# Altium schematic sheet 02-System.SchDoc: System Block Diagram
size A2; DocumentNumber: 2; SheetNumber: 2; SheetTotal: 15
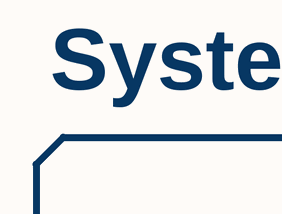
[diagram p0: 02-System.SchDoc, top left]
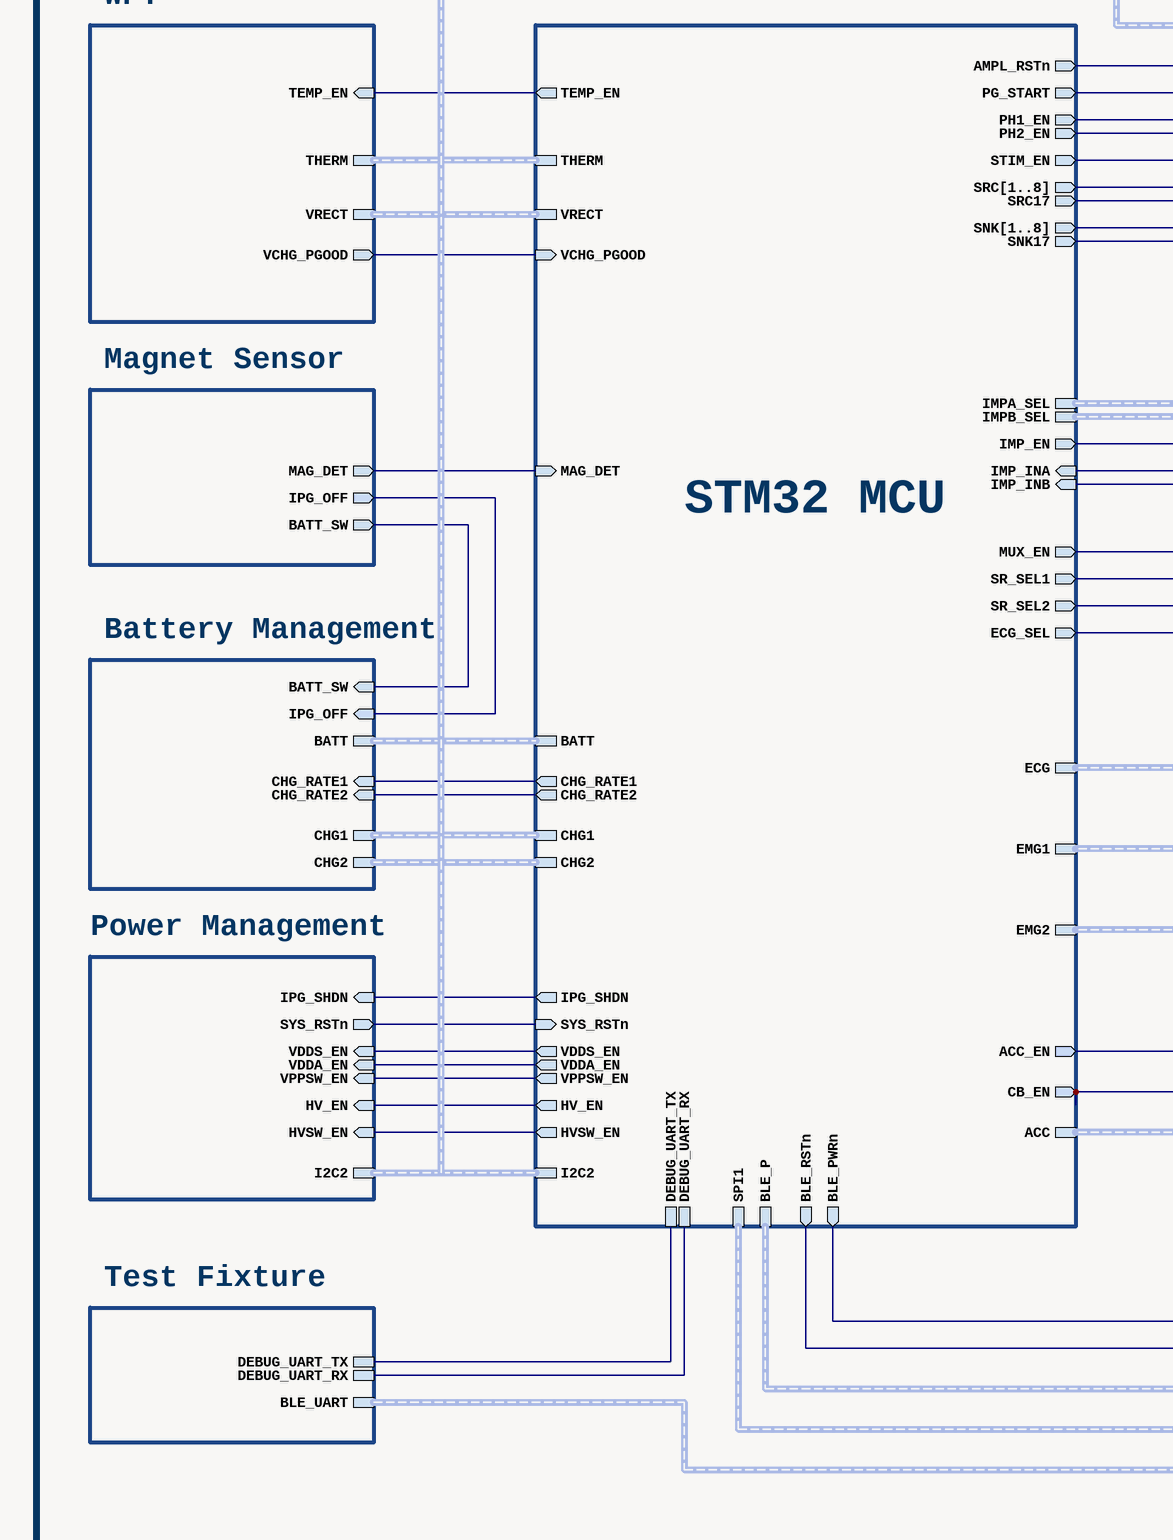
[diagram p1: 02-System.SchDoc, bottom left]
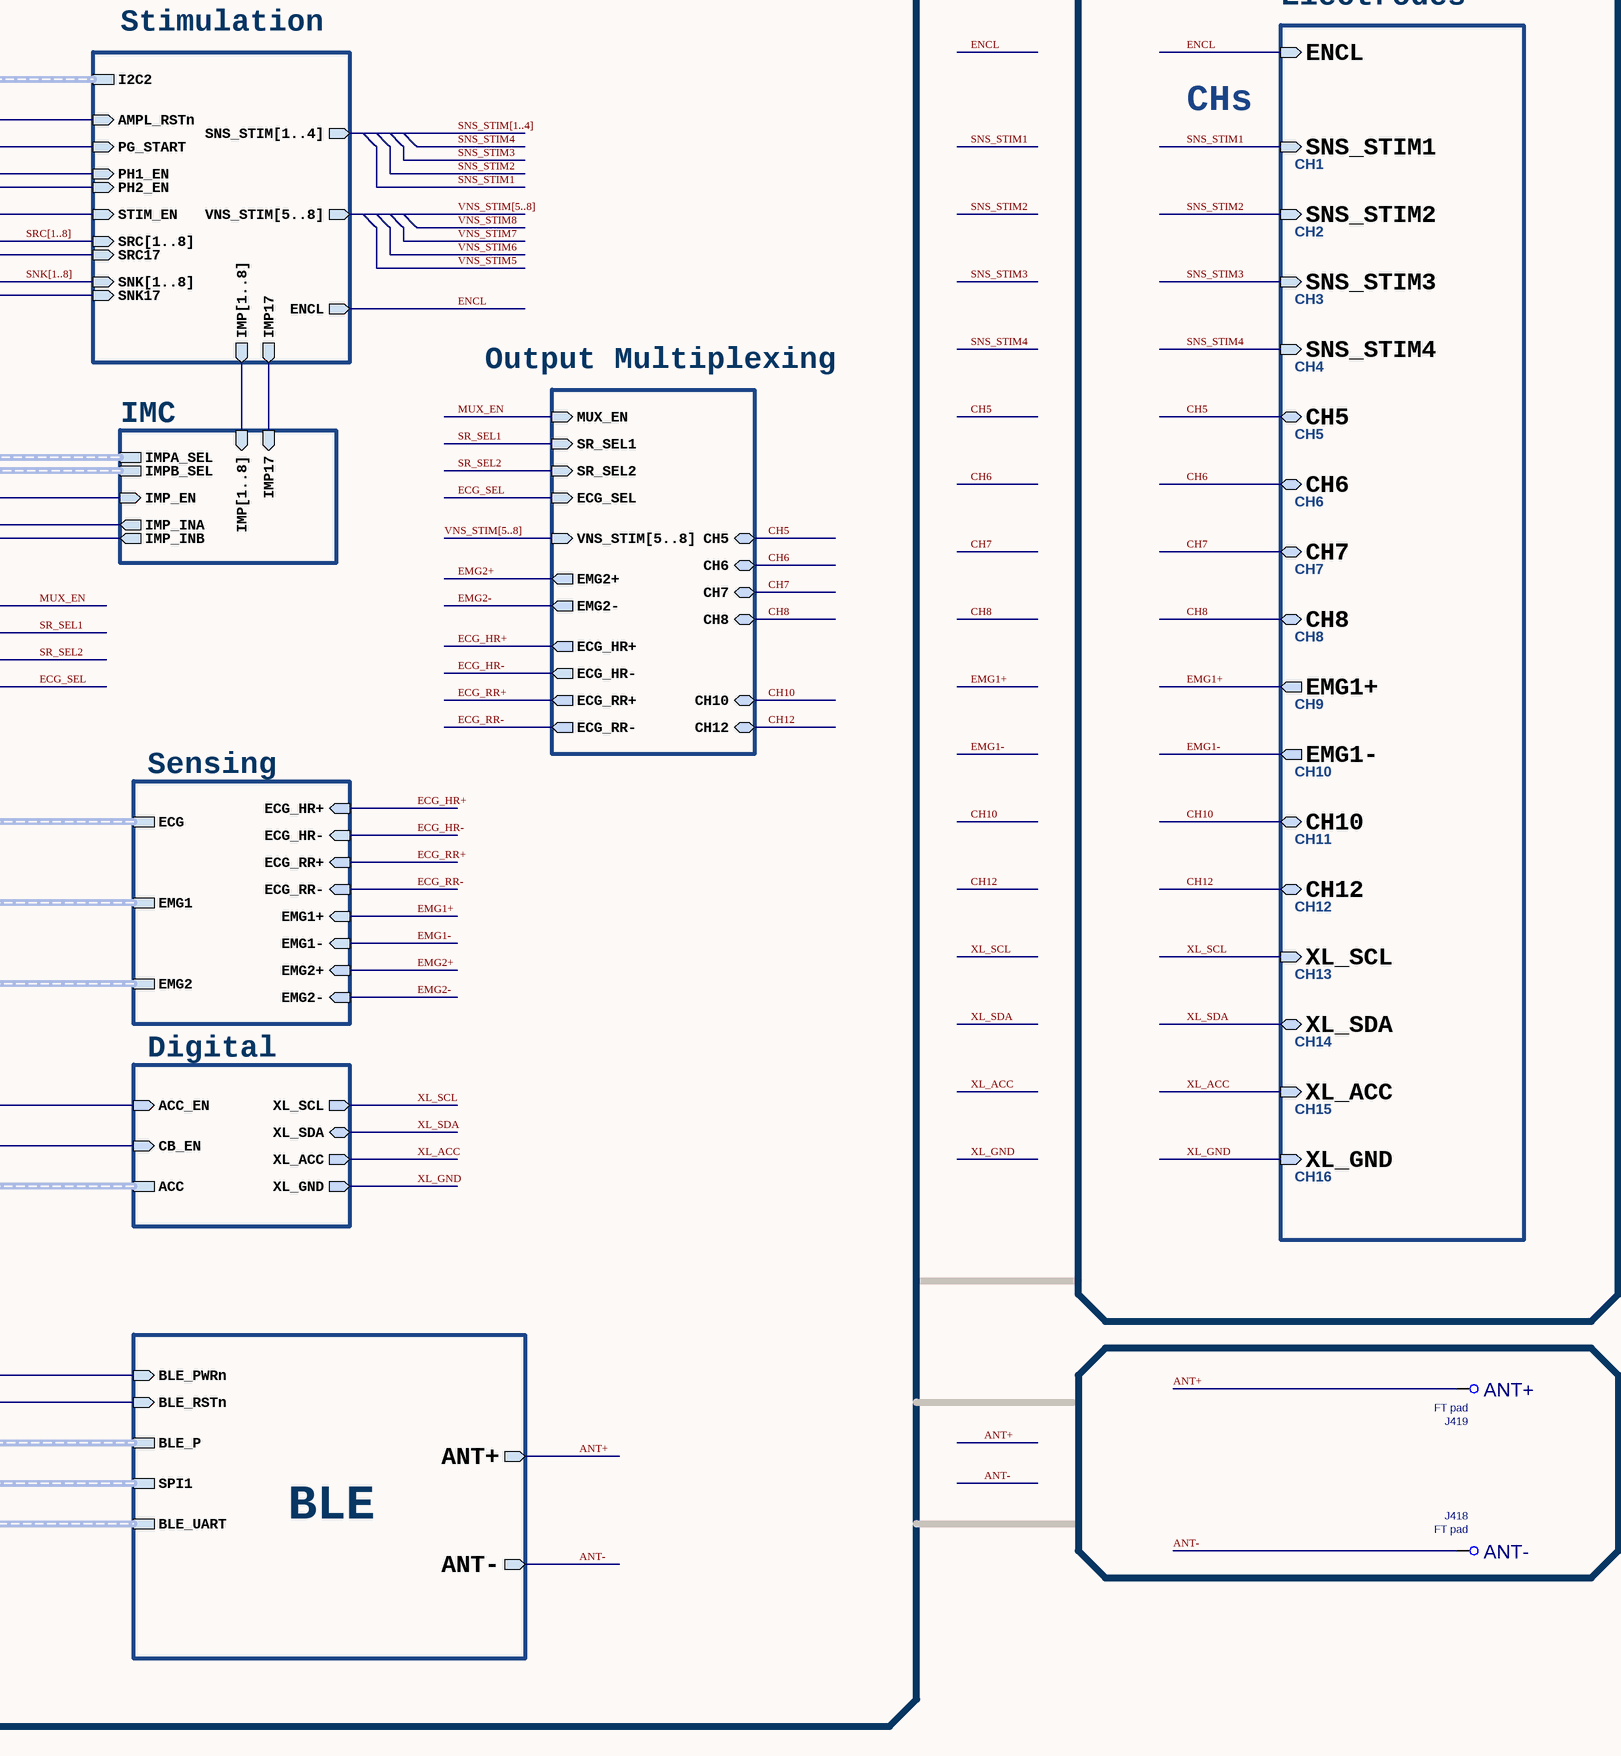
[diagram p2: 02-System.SchDoc, bottom right]

## Parts
J418  value FT pad  [FEEDHOLE_20mil]  (hidden comment: THPAD_20m)  (no BOM)
J419  value FT pad  [FEEDHOLE_20mil]  (hidden comment: THPAD_20m)  (no BOM)

## Sub-sheets
Battery Management = 06-BatteryManagement.SchDoc: CHG_RATE1 (in), CHG_RATE2 (in), BATT_SW (in), CHG1 (harness CHG_CTRL), CHG2 (harness CHG_CTRL), BATT (harness BATT), IPG_OFF (in)
BLE = 04-BLE.SchDoc: BLE_RSTn (in), BLE_PWRn (in), BLE_P (harness BLE PINS), ANT+ (out), ANT- (out), SPI1 (harness BLE_SPI), BLE_UART (harness UART)
Digital = 13-Digital.SchDoc: ACC_EN (in), CB_EN (in), ACC (harness I2C), XL_SCL (out), XL_SDA (bidir), XL_ACC (out), XL_GND (out)
Electrodes = 12-Electrodes.SchDoc: SNS_STIM1 (in), ENCL (in), SNS_STIM2 (in), SNS_STIM3 (in), SNS_STIM4 (in), CH5 (bidir), CH6 (bidir), CH7 (bidir), CH8 (bidir), EMG1+ (out), EMG1- (out), CH10 (bidir), CH12 (bidir), XL_SCL (in), XL_SDA (bidir), XL_ACC (in), XL_GND (in)
IMC = 09-IMC.SchDoc: IMP[1..8] (in), IMP17 (in), IMPA_SEL (harness MUX_SEL), IMPB_SEL (harness MUX_SEL), IMP_EN (in), IMP_INA (out), IMP_INB (out)
Magnet Sensor = 08-MagnetSensor.SchDoc: MAG_DET (out), BATT_SW (out), IPG_OFF (out)
Output Multiplexing = 15-OutputMultiplexing.SchDoc: MUX_EN (in), SR_SEL1 (in), SR_SEL2 (in), ECG_SEL (in), VNS_STIM[5..8] (in), EMG2+ (out), EMG2- (out), ECG_HR- (out), ECG_HR+ (out), ECG_RR+ (out), ECG_RR- (out), CH5 (bidir), CH6 (bidir), CH7 (bidir), CH8 (bidir), CH10 (bidir), CH12 (bidir)
Power Management = 07-PowerManagement.SchDoc: IPG_SHDN (in), SYS_RSTn (out), HVSW_EN (in), HV_EN (in), VPPSW_EN (in), VDDS_EN (in), VDDA_EN (in), I2C2 (harness I2C)
Sensing = 10-Sensing.SchDoc: EMG1+ (in), EMG1- (in), ECG_HR- (in), EMG1 (harness EMG), ECG (harness ECG), ECG_HR+ (in), EMG2 (harness EMG), ECG_RR+ (in), ECG_RR- (in), EMG2+ (in), EMG2- (in)
Stimulation = 11-Stimulation.SchDoc: PG_START (in), AMPL_RSTn (in), PH1_EN (in), PH2_EN (in), STIM_EN (in), SRC[1..8] (in), SRC17 (in), SNK[1..8] (in), SNK17 (in), SNS_STIM[1..4] (out), ENCL (out), IMP[1..8] (out), IMP17 (out), VNS_STIM[5..8] (out), I2C2 (harness I2C)
STM32 MCU = 03-MCU.SchDoc: IMPA_SEL (harness MUX_SEL), IMPB_SEL (harness MUX_SEL), IMP_INB (in), IMP_EN (out), IMP_INA (in), SYS_RSTn (in), BLE_P (harness BLE PINS), MAG_DET (in), BLE_RSTn (out), BLE_PWRn (out), BATT (harness BATT), VPPSW_EN (out), HV_EN (out), CHG1 (harness CHG_CTRL), HVSW_EN (out), IPG_SHDN (out), CHG_RATE2 (out), CHG_RATE1 (out), CHG2 (harness CHG_CTRL), ECG (harness ECG), EMG1 (harness EMG), SRC[1..8] (out), SRC17 (out), VCHG_PGOOD (in), SNK[1..8] (out), SNK17 (out), PH2_EN (out), PH1_EN (out), AMPL_RSTn (out), THERM (harness THERMAL CTRL), VRECT (harness VRECT MON), STIM_EN (out), PG_START (out), TEMP_EN (out), VDDA_EN (out), VDDS_EN (out), SR_SEL2 (out), SR_SEL1 (out), MUX_EN (out), EMG2 (harness EMG), ACC_EN (out), CB_EN (out), ACC (harness I2C), ECG_SEL (out), SPI1 (harness BLE_SPI), DEBUG_UART_TX, DEBUG_UART_RX, I2C2 (harness I2C)
Test Fixture = 14-TestFixture.SchDoc: DEBUG_UART_TX, DEBUG_UART_RX, BLE_UART (harness UART)
WPT = 05-WPT.SchDoc: VCHG_PGOOD (out), TEMP_EN (in), THERM (harness THERMAL CTRL), VRECT (harness VRECT MON)

## Nets
ANT+: J419.1 ; sheet BLE/ANT+
ANT-: J418.1 ; sheet BLE/ANT-
CH5: sheet Electrodes/CH5, sheet Output Multiplexing/CH5
CH6: sheet Electrodes/CH6, sheet Output Multiplexing/CH6
CH7: sheet Electrodes/CH7, sheet Output Multiplexing/CH7
CH8: sheet Electrodes/CH8, sheet Output Multiplexing/CH8
CH10: sheet Electrodes/CH10, sheet Output Multiplexing/CH10
CH12: sheet Electrodes/CH12, sheet Output Multiplexing/CH12
ECG_HR+: sheet Sensing/ECG_HR+, sheet Output Multiplexing/ECG_HR+
ECG_HR-: sheet Sensing/ECG_HR-, sheet Output Multiplexing/ECG_HR-
ECG_RR+: sheet Sensing/ECG_RR+, sheet Output Multiplexing/ECG_RR+
ECG_RR-: sheet Sensing/ECG_RR-, sheet Output Multiplexing/ECG_RR-
ECG_SEL: sheet STM32 MCU/ECG_SEL, sheet Output Multiplexing/ECG_SEL
EMG1+: sheet Electrodes/EMG1+, sheet Sensing/EMG1+
EMG1-: sheet Electrodes/EMG1-, sheet Sensing/EMG1-
EMG2+: sheet Sensing/EMG2+, sheet Output Multiplexing/EMG2+
EMG2-: sheet Sensing/EMG2-, sheet Output Multiplexing/EMG2-
ENCL: sheet Electrodes/ENCL, sheet Stimulation/ENCL
MUX_EN: sheet STM32 MCU/MUX_EN, sheet Output Multiplexing/MUX_EN
SNS_STIM1: sheet Electrodes/SNS_STIM1
SNS_STIM2: sheet Electrodes/SNS_STIM2
SNS_STIM3: sheet Electrodes/SNS_STIM3
SNS_STIM4: sheet Electrodes/SNS_STIM4
SR_SEL1: sheet STM32 MCU/SR_SEL1, sheet Output Multiplexing/SR_SEL1
SR_SEL2: sheet STM32 MCU/SR_SEL2, sheet Output Multiplexing/SR_SEL2
XL_ACC: sheet Electrodes/XL_ACC, sheet Digital/XL_ACC
XL_GND: sheet Electrodes/XL_GND, sheet Digital/XL_GND
XL_SCL: sheet Electrodes/XL_SCL, sheet Digital/XL_SCL
XL_SDA: sheet Electrodes/XL_SDA, sheet Digital/XL_SDA
(unnamed): sheet Battery Management/CHG_RATE1, sheet STM32 MCU/CHG_RATE1
(unnamed): sheet Battery Management/CHG_RATE2, sheet STM32 MCU/CHG_RATE2
(unnamed): sheet Battery Management/BATT_SW, sheet Magnet Sensor/BATT_SW
(unnamed): sheet Battery Management/IPG_OFF, sheet Magnet Sensor/IPG_OFF
(unnamed): sheet BLE/BLE_RSTn, sheet STM32 MCU/BLE_RSTn
(unnamed): sheet BLE/BLE_PWRn, sheet STM32 MCU/BLE_PWRn
(unnamed): sheet IMC/IMP17, sheet Stimulation/IMP17
(unnamed): sheet IMC/IMP_EN, sheet STM32 MCU/IMP_EN
(unnamed): sheet IMC/IMP_INA, sheet STM32 MCU/IMP_INA
(unnamed): sheet IMC/IMP_INB, sheet STM32 MCU/IMP_INB
(unnamed): sheet Magnet Sensor/MAG_DET, sheet STM32 MCU/MAG_DET
(unnamed): sheet STM32 MCU/SYS_RSTn, sheet Power Management/SYS_RSTn
(unnamed): sheet STM32 MCU/VPPSW_EN, sheet Power Management/VPPSW_EN
(unnamed): sheet STM32 MCU/HV_EN, sheet Power Management/HV_EN
(unnamed): sheet STM32 MCU/HVSW_EN, sheet Power Management/HVSW_EN
(unnamed): sheet STM32 MCU/IPG_SHDN, sheet Power Management/IPG_SHDN
(unnamed): sheet STM32 MCU/SRC17, sheet Stimulation/SRC17
(unnamed): sheet STM32 MCU/VCHG_PGOOD, sheet WPT/VCHG_PGOOD
(unnamed): sheet STM32 MCU/SNK17, sheet Stimulation/SNK17
(unnamed): sheet STM32 MCU/PH2_EN, sheet Stimulation/PH2_EN
(unnamed): sheet STM32 MCU/PH1_EN, sheet Stimulation/PH1_EN
(unnamed): sheet STM32 MCU/AMPL_RSTn, sheet Stimulation/AMPL_RSTn
(unnamed): sheet STM32 MCU/STIM_EN, sheet Stimulation/STIM_EN
(unnamed): sheet STM32 MCU/PG_START, sheet Stimulation/PG_START
(unnamed): sheet STM32 MCU/TEMP_EN, sheet WPT/TEMP_EN
(unnamed): sheet STM32 MCU/VDDA_EN, sheet Power Management/VDDA_EN
(unnamed): sheet STM32 MCU/VDDS_EN, sheet Power Management/VDDS_EN
(unnamed): sheet STM32 MCU/ACC_EN, sheet Digital/ACC_EN
(unnamed): sheet STM32 MCU/CB_EN, sheet Digital/CB_EN
(unnamed): sheet STM32 MCU/DEBUG_UART_TX, sheet Test Fixture/DEBUG_UART_TX
(unnamed): sheet STM32 MCU/DEBUG_UART_RX, sheet Test Fixture/DEBUG_UART_RX

## Buses and harness runs
bus sheet IMC/IMP[1..8] = sheet Stimulation/IMP[1..8]
bus SNK[1..8] = sheet Stimulation/SNK[1..8] = sheet STM32 MCU/SNK[1..8]
bus SNS_STIM[1..4] = sheet Stimulation/SNS_STIM[1..4]
bus SRC[1..8] = sheet Stimulation/SRC[1..8] = sheet STM32 MCU/SRC[1..8]
bus VNS_STIM[5..8] = sheet Output Multiplexing/VNS_STIM[5..8]
bus VNS_STIM[5..8] = sheet Stimulation/VNS_STIM[5..8]
harness sheet Battery Management/BATT = sheet STM32 MCU/BATT
harness sheet Battery Management/CHG1 = sheet STM32 MCU/CHG1
harness sheet Battery Management/CHG2 = sheet STM32 MCU/CHG2
harness sheet BLE/BLE_P = sheet STM32 MCU/BLE_P
harness sheet BLE/BLE_UART = sheet Test Fixture/BLE_UART
harness sheet BLE/SPI1 = sheet STM32 MCU/SPI1
harness sheet Digital/ACC = sheet STM32 MCU/ACC
harness sheet IMC/IMPA_SEL = sheet STM32 MCU/IMPA_SEL
harness sheet IMC/IMPB_SEL = sheet STM32 MCU/IMPB_SEL
harness sheet Power Management/I2C2 = sheet Stimulation/I2C2 = sheet STM32 MCU/I2C2
harness sheet Sensing/ECG = sheet STM32 MCU/ECG
harness sheet Sensing/EMG1 = sheet STM32 MCU/EMG1
harness sheet Sensing/EMG2 = sheet STM32 MCU/EMG2
harness sheet STM32 MCU/THERM = sheet WPT/THERM
harness sheet STM32 MCU/VRECT = sheet WPT/VRECT

## Notes on the sheet
- System Block Diagram
- CHs
- CH1
- CH2
- CH3
- CH4
- CH5
- CH6
- CH7
- CH8
- CH9
- CH10
- CH11
- CH12
- CH13
- CH14
- CH15
- CH16
- (near J419) ANT+
- (near J418) ANT-
- Project:
- Schematic:
- Design by:
- Date:
- Ver:
- .
- Comments:
- Reviewed by:

## Library data of the parts
J418 J419 = HOLE_20m: FT pad, Thru-hole, 20 mil hole; PCB Footprint: TBD; Category: FT pad; Length (mm): TBD; Manufacturer: N/A; Manufacturer PN: N/A; Medical Grade MFR: N/A; Medical Grade MFR PN: N/A; Rating: N/A; Thickness (mm): N/A; Width (mm): TBD; Package Description: FT pad; Status: *; Review: *